# Altium schematic sheet Sensor.SchDoc: main_assy PCB
size A4
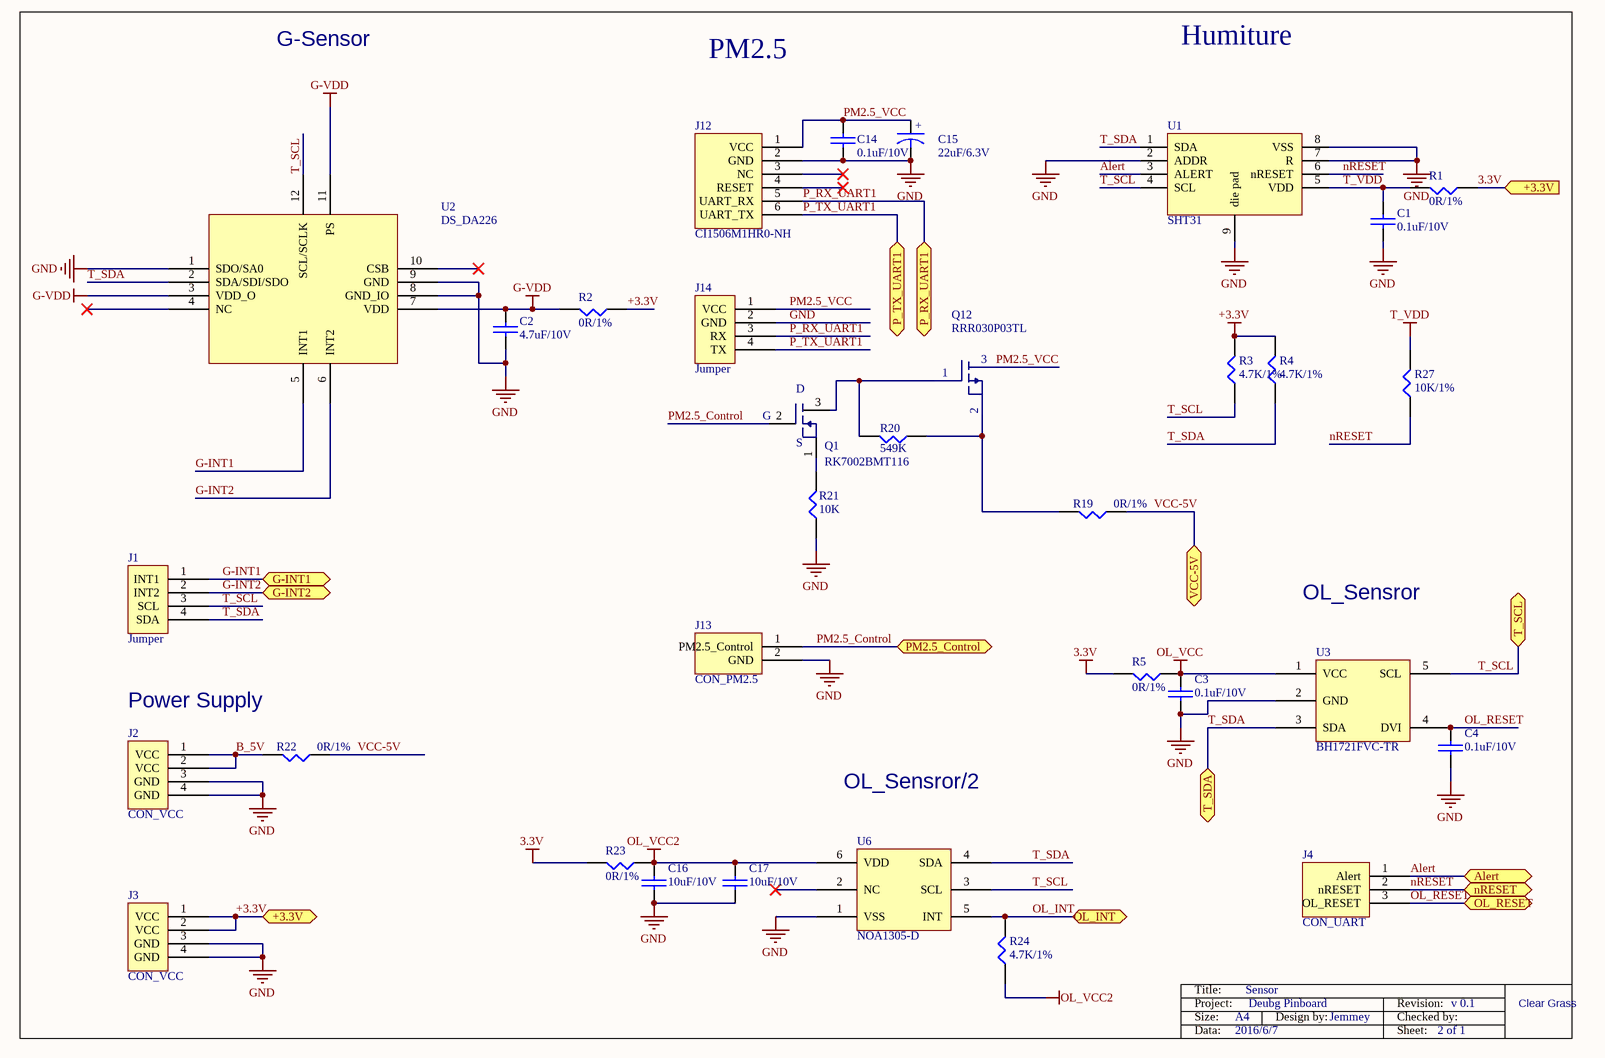
[diagram p0: Sensor.SchDoc]

## Parts
C1  0.1uF/10V  [0402C]
C2  4.7uF/10V  [0402C]
C3  0.1uF/10V  [0402C]
C4  0.1uF/10V  [0402C]
C14  0.1uF/10V  [0402C]
C15  22uF/6.3V  [3216]
C16  10uF/10V  [0603C]
C17  10uF/10V  [0603C]
J1  Jumper  [2.54*4]
J2  CON_VCC  [2.54*4]
J3  CON_VCC  [2.54*4]
J4  CON_UART  [2.54*3]
J12  CI1506M1HR0-NH  [WTB_SIDE_6PIN]
J13  CON_PM2.5  [2.54*2]
J14  Jumper  [2.54*4]
Q1  RK7002BMT116  [SOT23]
Q12  RRR030P03TL  [TSMT3]
R1  0R/1%  [0603R]
R2  0R/1%  [0603R]
R3  4.7K/1%  [0402R]
R4  4.7K/1%  [0402R]
R5  0R/1%  [0603R]
R19  0R/1%  [0603R]
R20  549K  [0402R]
R21  10K  [0402R]
R22  0R/1%  [0603R]
R23  0R/1%  [0603R]
R24  4.7K/1%  [0402R]
R27  10K/1%  [0402R]
U1  SHT31  [DFN]
U2  DS_DA226  [LGA-12]
U3  BH1721FVC-TR  [WSOF5]
U6  NOA1305-D  [CUDFN6]

## Ports
+3.3V, +3.3V (in), Alert, G-INT1, G-INT2, nRESET, OL_INT, OL_RESET, P_RX_UART1, P_TX_UART1, PM2.5_Control, T_SCL, T_SDA, VCC-5V

## Nets
+3.3V: J3.1(VCC) J3.2(VCC) R1.1 R2.1 R3.2 R4.2 R5.2 R23.2 ; port +3.3V  [also labelled 3.3V]
G-VDD: C2.1 R2.2 U2.3(VDD_O) U2.7(VDD) U2.11(PS)
GND: C1.2 C2.2 C3.2 C4.2 C14.2 C15.2 C16.2 C17.2 J2.3(GND) J2.4(GND) J3.3(GND) J3.4(GND) J12.2(GND) J13.2(GND) J14.2(GND) R21.1 U1.2(ADDR) U1.7(R) U1.8(VSS) U1.9(die_pad) U2.1(SDO/SA0) U2.8(GND_IO) U2.9(GND) U3.2(GND) U6.1(VSS)
OL_VCC: C3.1 R5.1 U3.1(VCC)
OL_VCC2: C16.1 C17.1 R23.1 R24.1 U6.6(VDD)
T_VDD: C1.1 R1.2 R27.2 U1.5(VDD)
Alert: J4.1(Alert) U1.3(ALERT) ; port Alert
B_5V: J2.1(VCC) J2.2(VCC) R22.2
G-INT1: J1.1(INT1) U2.5(INT1) ; port G-INT1
G-INT2: J1.2(INT2) U2.6(INT2) ; port G-INT2
nRESET: J4.2(nRESET) R27.1 U1.6(nRESET) ; port nRESET
OL_INT: R24.2 U6.5(INT) ; port OL_INT
OL_RESET: C4.1 J4.3(OL_RESET) U3.4(DVI) ; port OL_RESET
P_RX_UART1: J12.5(UART_RX) J14.3(RX) ; port P_RX_UART1
P_TX_UART1: J12.6(UART_TX) J14.4(TX) ; port P_TX_UART1
PM2.5_Control: J13.1(PM2.5_Control) Q1.2(G) ; port PM2.5_Control
PM2.5_VCC: C14.1 C15.1 J12.1(VCC) J14.1(VCC) Q12.3(D)
T_SCL: J1.3(SCL) R3.1 U1.4(SCL) U2.12(SCL/SCLK) U3.5(SCL) U6.3(SCL) ; port T_SCL
T_SDA: J1.4(SDA) R4.1 U1.1(SDA) U2.2(SDA/SDI/SDO) U3.3(SDA) U6.4(SDA) ; port T_SDA
VCC-5V: R19.1 R22.1 ; port VCC-5V
NetQ1_1: Q1.1(S) R21.2
NetQ1_3: Q1.3(D) Q12.1(G) R20.2
NetQ12_2: Q12.2(S) R19.2 R20.1

Not connected (* = marked no-connect by the designer): J12 3(NC)* 4(RESET)*; U2 4(NC)* 10(CSB)*; U6 2(NC)*

## Notes on the sheet
- G-Sensor
- Humiture
- PM2.5
- OL_Sensror
- Power Supply
- OL_Sensror/2
- Title:
- Sensor
- Project:
- Size:
- Data:
- A4
- 2016/6/7
- Deubg Pinboard
- Design by:
- Jemmey
- Revision:
- Sheet:
- Checked by:
- 2 of 1
- v 0.1
- Clear Grass
- (in symbol Cap) +

## Library data of the parts
C1 C2 = CAP: 厂家：Murata，型号：GRM155R71A104KA01D
C3 C4 C14 C16 C17 = CAP: 厂家：Murata，型号：
C15 = Cap: 厂家：ROHM，型号：TAJC227K010RNJ
J1 = Jumper*4
J12 = CI15: 厂家：瀚荃股份，型号：CI1506M1HR0-NH
J14 = Jumper*4*PM25
Q1 = RK7002: 厂家：ROHM，型号：RK7002BMT116
Q12 = PMOS: 厂家：ROHM，型号：RRR030P03TL
R1-R5 R23 R24 R27 = RES1: 厂家：Yageo，型号：RC0402FR-0710KL
R19 R22 = RES1: 厂家：Yageo，型号：RC0402FR-070RL
R20 R21 = RES1
U1 = SHT31: 厂家：盛思睿，型号：SHT31
U2 = LI: 厂家：ST，型号：LIS2DH12